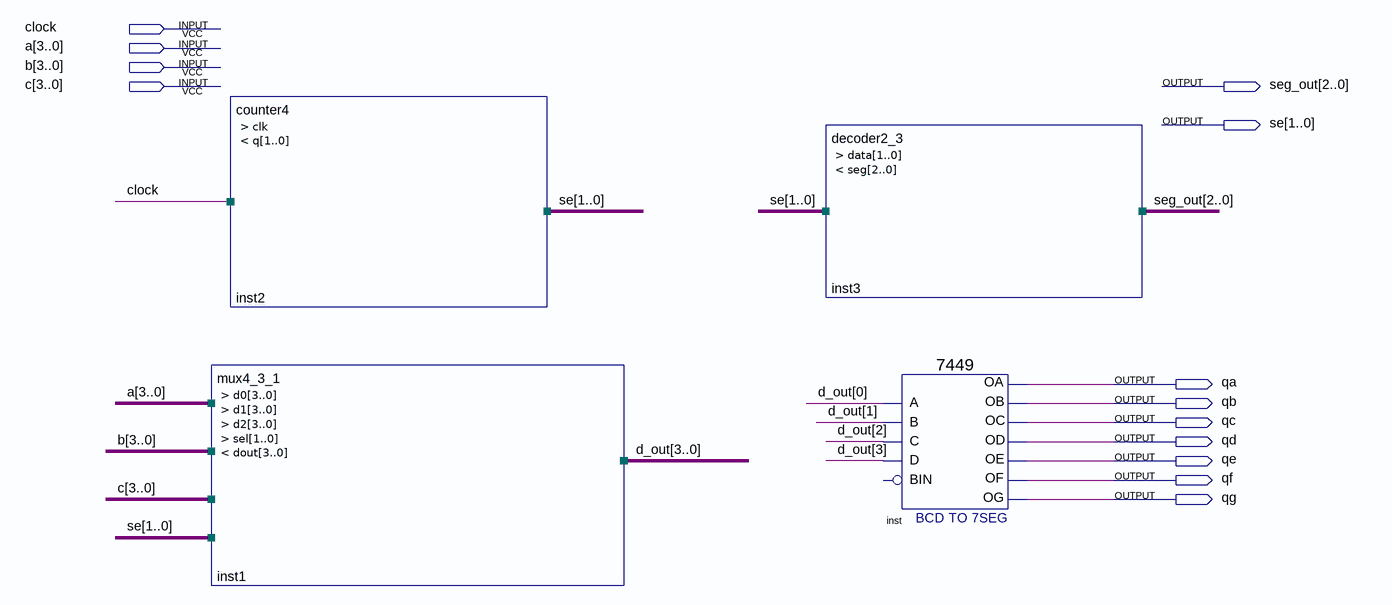
[diagram p0: schematic sheet]
// Quartus schematic scan_led.bdf as structural Verilog: 4 symbols, 13 pins
module scan_led (
  input  clock,
  input  [3:0] a,
  input  [3:0] b,
  input  [3:0] c,
  output [2:0] seg_out,
  output [1:0] se,
  output qa,
  output qb,
  output qc,
  output qd,
  output qe,
  output qf,
  output qg
);

  wire [3:0] d_out;

  counter4 inst2 (.clk(clock), .q(se));
  mux4_3_1 inst1 (.d0(a), .d1(b), .d2(c), .sel(se), .dout(d_out));
  decoder2_3 inst3 (.data(se), .seg(seg_out));
  \7449  inst (
    .A(d_out[0]), .C(d_out[2]), .B(d_out[1]), .D(d_out[3]), .OC(qc), .OD(qd), .OF(qf), .OG(qg), .OB(qb),
    .OA(qa), .OE(qe));  // open: BIN
endmodule
